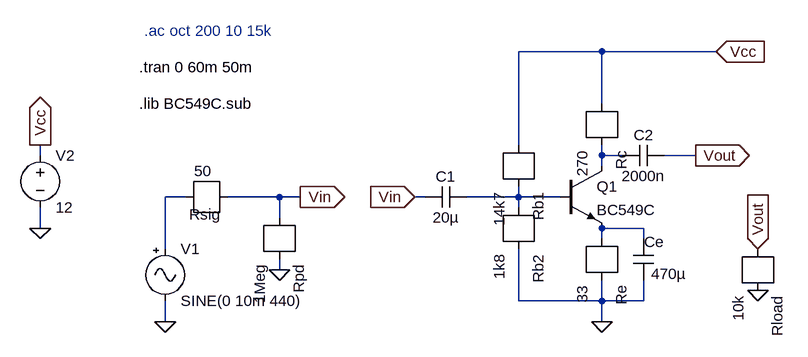
[diagram p0: schematic BC549C-amp.asc]
BC549C-amp.asc, the LTspice schematic file:
Version 4
SHEET 1 892 680
WIRE 592 80 464 80
WIRE 768 80 592 80
WIRE 592 160 592 80
WIRE 464 224 464 80
WIRE -272 240 -272 224
WIRE 592 240 592 224
WIRE 624 240 592 240
WIRE 736 240 688 240
WIRE 592 256 592 240
WIRE -48 304 -80 304
WIRE 96 304 16 304
WIRE 128 304 96 304
WIRE 320 304 304 304
WIRE 464 304 464 288
WIRE 464 304 384 304
WIRE 528 304 464 304
WIRE 464 320 464 304
WIRE 96 336 96 304
WIRE -272 352 -272 320
WIRE 656 352 592 352
WIRE 592 368 592 352
WIRE 656 368 656 352
WIRE -80 384 -80 304
WIRE 96 416 96 400
WIRE 464 464 464 384
WIRE 592 464 592 432
WIRE 592 464 464 464
WIRE 656 464 656 432
WIRE 656 464 592 464
WIRE -80 496 -80 464
WIRE 592 496 592 464
FLAG -80 496 0
FLAG -272 352 0
FLAG -272 224 Vcc
IOPIN -272 224 Out
FLAG 128 304 Vin
IOPIN 128 304 Out
FLAG 304 304 Vin
IOPIN 304 304 In
FLAG 736 240 Vout
IOPIN 736 240 Out
FLAG 768 80 Vcc
IOPIN 768 80 In
FLAG 592 496 0
FLAG 832 448 0
FLAG 832 384 Vout
IOPIN 832 384 In
FLAG 96 416 0
SYMBOL npn 528 256 R0
SYMATTR InstName Q1
SYMATTR Value BC549C
SYMBOL signal -80 368 R0
SYMATTR InstName V1
SYMATTR Value SINE(0 10m 440)
SYMATTR Value2 AC 10m
SYMBOL r -48 304 R0
WINDOW 0 53 27 Right 2
WINDOW 3 40 -40 Right 2
SYMATTR InstName Rsig
SYMATTR Value 50
SYMBOL voltage -272 224 R0
SYMATTR InstName V2
SYMATTR Value 12
SYMBOL r 592 160 R90
SYMATTR InstName Rc
SYMATTR Value 270
SYMBOL cap 384 288 R90
WINDOW 0 0 32 VBottom 2
WINDOW 3 32 32 VTop 2
SYMATTR InstName C1
SYMATTR Value 20µ
SYMBOL r 464 224 R90
SYMATTR InstName Rb1
SYMATTR Value 14k7
SYMBOL r 464 320 R90
SYMATTR InstName Rb2
SYMATTR Value 1k8
SYMBOL r 592 368 R90
SYMATTR InstName Re
SYMATTR Value 33
SYMBOL r 832 384 R90
SYMATTR InstName Rload
SYMATTR Value 10k
SYMBOL cap 688 224 R90
WINDOW 0 0 32 VBottom 2
WINDOW 3 32 32 VTop 2
SYMATTR InstName C2
SYMATTR Value 2000n
SYMBOL r 96 336 R90
SYMATTR InstName Rpd
SYMATTR Value 1Meg
SYMBOL cap 672 432 R180
WINDOW 0 -16 59 Left 2
WINDOW 3 -50 10 Left 2
SYMATTR InstName Ce
SYMATTR Value 470µ
TEXT -120 104 Left 2 !.tran 0 60m 50m
TEXT -120 160 Left 2 !.lib BC549C.sub
TEXT -112 48 Left 2 ;.ac oct 200 10 15k

The netlist it stands for:
* BC549C-amp.asc
Q1 N001 N003 N004 0 BC549C
V1 N002 0 SINE(0 10m 440) AC 10m
Rsig Vin N002 50
V2 Vcc 0 12
Rc N001 Vcc 270
C1 N003 Vin 20µ
Rb1 N003 Vcc 14k7
Rb2 0 N003 1k8
Re 0 N004 33
Rload 0 Vout 10k
C2 Vout N001 2000n
Rpd 0 Vin 1Meg
Ce 0 N004 470µ
.model NPN NPN
.model PNP PNP
.lib standard.bjt
.tran 0 60m 50m
.lib BC549C.sub
* .ac oct 200 10 15k
.backanno
.end